# Altium schematic sheet ESP.SchDoc
size A4
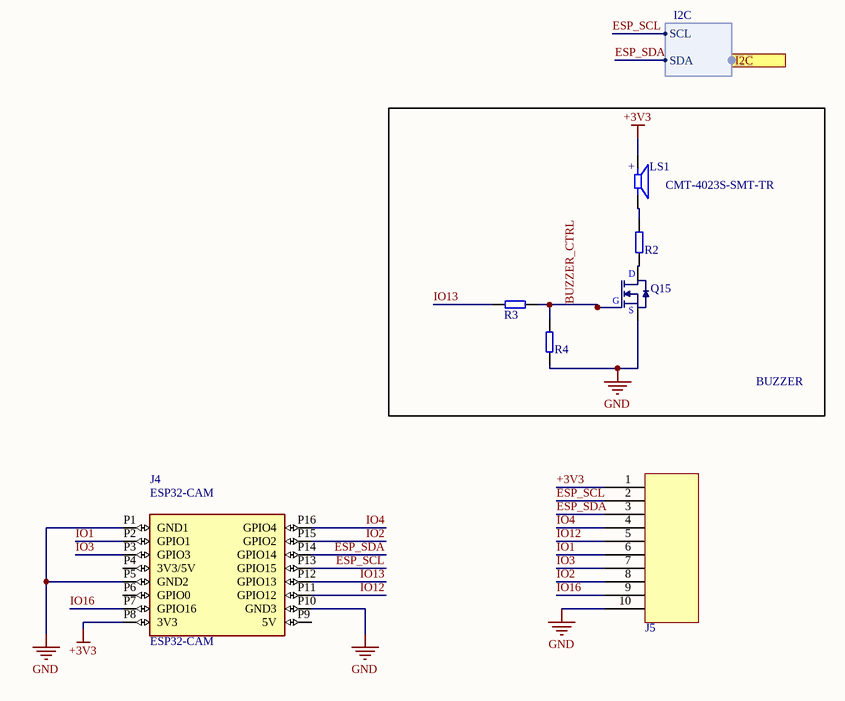
[diagram p0: ESP.SchDoc]

## Parts
J4  ESP32-CAM  [ESP32-CAM]
J5  54202-T0805LF  [10P_2.54MM_SMD]  (value not drawn)
LS1  CMT-4023S-SMT-TR  [Buzzer]
Q15  NTK3043NT1G  [SOT-723]  (value not drawn)
R2  1K  [R0402]  (value not drawn)
R3  1K  [R0402]  (value not drawn)
R4  1K  [R0402]  (value not drawn)

## Blocks framed on the sheet
BUZZER: LS1 Q15 R2-R4

## Ports
I2C (harness I2C)

## Harnesses
I2C: SCL, SDA

## Nets
+3V3: J4.P8(3V3) J5.1 LS1.P
GND: J4.P1(GND1) J4.P5(GND2) J4.P10(GND3) J5.10 Q15.2(S) R4.1
BUZZER_CTRL: Q15.1(G) R3.2 R4.2
ESP_SCL: J4.P13(GPIO15) J5.2 ; port I2C.SCL
ESP_SDA: J4.P14(GPIO14) J5.3 ; port I2C.SDA
IO1: J4.P2(GPIO1) J5.6
IO2: J4.P15(GPIO2) J5.8
IO3: J4.P3(GPIO3) J5.7
IO4: J4.P16(GPIO4) J5.4
IO12: J4.P11(GPIO12) J5.5
IO13: J4.P12(GPIO13) R3.1
IO16: J4.P7(GPIO16) J5.9
NetLS1_N: LS1.N R2.2
NetQ15_3: Q15.3(D) R2.1

Not connected (* = marked no-connect by the designer): J4 P4(3V3/5V) P6(GPIO0) P9(5V)

## Notes on the sheet
- (in symbol CMT-4023S-SMT-TR) +

## Library data of the parts
J4 = ESP32-CAM: CAMERA MODULE; Que: 041; MF: AI-Thinker; Part Number: ESP32-CAM; SnapEDA_Link: https://www.snapeda.com/parts/ESP32-CAM/AI-Thinker/view-part/?ref=snap; Package: None; Value: *; MP: ESP32-CAM; Check_prices: https://www.snapeda.com/parts/ESP32-CAM/AI-Thinker/view-part/?ref=eda
J5 = 54202-T0805LF: CONN HEADER SMD 10POS 2.54MM; Manufacturer: Amphenol ICC (FCI); Que: 056; Number of Position: 10; Connector Style: Header,Male Pin; Name: Ahmet Kemal Ayyildiz; Part Number: 54202-T0805LF; Mounting Type: Surface Mount; Contact Finish: Tin; Datasheet: http://portal.fciconnect.com/Comergent//fci/drawing/54202.pdf; Manufacturer Part Number: 54202-T0805LF; Date: 02.02.2022
LS1 = CMT-4023S-SMT-TR: AUDIO MAGNETIC XDCR 2-4V SMD; Manufacturer: CUI; Voltage Rating: 3V; Frequency: 4kHz; Operating Supply Current: 90mA; Supplier 1: Digi-Key; Stock 1: 2591; Pricing 1: 1=2.78, 10=2.3, 25=2.1236, 50=1.9952, 100=1.8717, 500=1.6036, 1000=1.586 (USD); Mount: Surface Mount; Min Operating Temperature: -20°C; Max Operating Temperature: 70°C; Sensing Method: Magnetic; Packaging: Tape and Reel; Termination: Solder; Length: 4mm; Width: 4mm; Lead Free: Lead Free; ComponentLink1URL: https://www.cui.com/product/resource/digikeypdf/cmt-4023s-smt.pdf?src-supplier=Digi-Key; ComponentLink1Description: https://www.cui.com/product/resource/digikeypdf/cmt-4023s-smt.pdf?src-supplier=Digi-Key; ComponentLink2URL: http://www.cui.com/product/resource/digikeypdf/cmt-4023s-smt.pdf?src-supplier=Digi-Key; ComponentLink2Description: http://www.cui.com/product/resource/digikeypdf/cmt-4023s-smt.pdf?src-supplier=Digi-Key; Supplier Part Number 1: 102-3742-1-ND; Manufacturer Part Number: CMT-4023S-SMT-TR
Q15 = NTK3043NT1G: MOSFET N-CH 20V 210MA SOT723; Manufacturer: ON Semiconductor; Que: 009; Voltage: 1.65V, 4.5V; FET Type: N-Channel; Name: Recep Aydin; Part Number: NTK3043NT1G; Technology: MOSFET; Current: 210mA; Package: SOT-723; Datasheet: https://www.onsemi.com/pdf/datasheet/ntk3043n-d.pdf; Manufacturer Part Number: NTK3043NT1G
R2-R4 = RT0402BRE071KL: RES SMD 1K OHM 0.1% 1/16W 0402; Manufacturer: Yageo; Que: 015; Name: Recep Aydin; Part Number: RT0402BRE071KL; Tolerance: 0.1%; Resistor Type: Thick Film; Package: 0402; Datasheet: https://www.yageo.com/upload/media/product/productsearch/datasheet/rchip/PYu-RT_1-to-0.01_RoHS_L_12.pdf; Manufacturer Part Number: RT0402BRE071KL